# Altium schematic sheet PCB_3.SchDoc
size A4; SheetNumber: 1; SheetTotal: 4
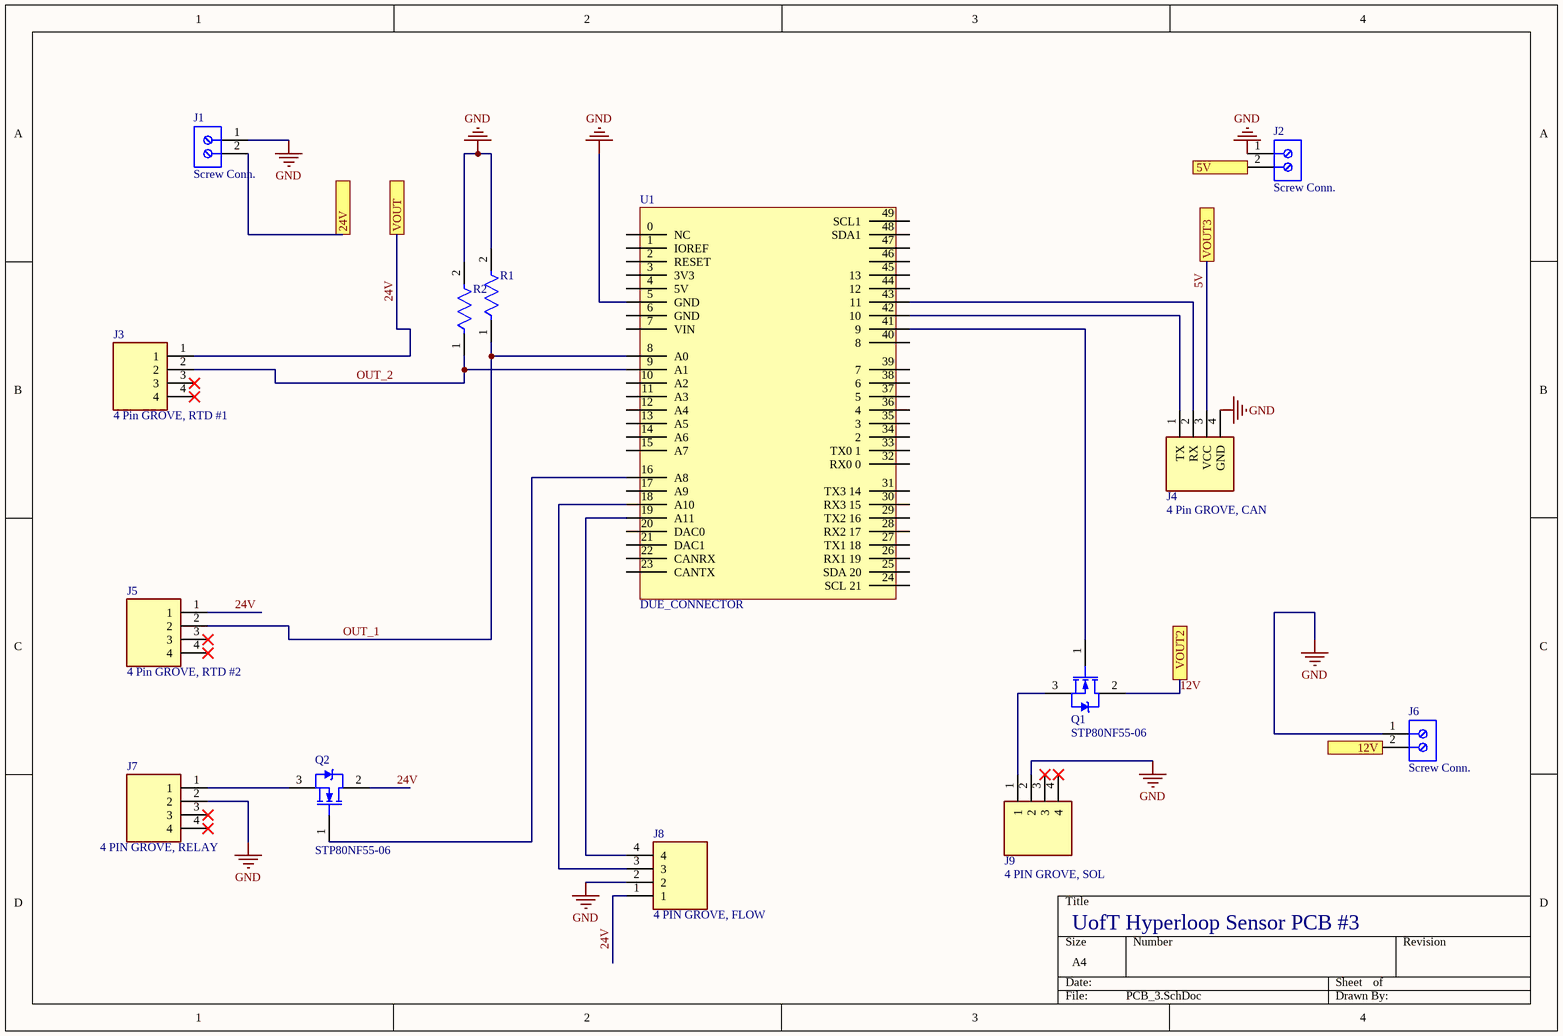
[diagram p0: PCB_3.SchDoc]

## Parts
J1  Screw Conn.  [PHOE-1714955_V]
J2  Screw Conn.  [PHOE-1714955_V]
J3  4 Pin GROVE, RTD #1  [SEEED_110990030]
J4  4 Pin GROVE, CAN  [SEEED_110990030]
J5  4 Pin GROVE, RTD #2  [SEEED_110990030]
J6  Screw Conn.  [PHOE-1714955_V]
J7  4 PIN GROVE, RELAY  [SEEED_110990030]
J8  4 PIN GROVE, FLOW  [SEEED_110990030]
J9  4 PIN GROVE, SOL  [SEEED_110990030]
Q1  STP80NF55-06  [STM-TO-220A-3]
Q2  STP80NF55-06  [STM-TO-220A-3]
R1  (no value)  [FP-MBA0204-MFG]
R2  (no value)  [FP-MBA0204-MFG]
U1  DUE_CONNECTOR  [DUE_FOOTPRINT]

## Ports
5V, 12V, 24V, VOUT, VOUT2, VOUT3

## Nets
GND: J1.1 J2.1 J4.4(GND) J6.1 J7.2 J8.2 J9.2 R1.2 R2.2 U1.5(GND)
5V: J4.3(VCC) ; port VOUT3
5V: J2.2 ; port 5V  [a separate net that carries the same name]
12V: Q1.2(D) ; port VOUT2
12V: J6.2 ; port 12V  [a separate net that carries the same name]
24V: J3.1 J5.1 J8.1 Q2.2(D) ; port VOUT
24V: J1.2 ; port 24V  [a separate net that carries the same name]
OUT_1: J5.2 R1.1 U1.8(A0)
OUT_2: J3.2 R2.1 U1.9(A1)
NetJ4_1: J4.1(TX) U1.42(10)
NetJ4_2: J4.2(RX) U1.43(11)
NetJ7_1: J7.1 Q2.3(S)
NetJ8_3: J8.3 U1.18(A10)
NetJ8_4: J8.4 U1.19(A11)
NetJ9_1: J9.1 Q1.3(S)
NetQ1_1: Q1.1(G) U1.41(9)
NetQ2_1: Q2.1(G) U1.16(A8)

Not connected (* = marked no-connect by the designer): J3 3* 4*; J5 3* 4*; J7 3* 4*; J9 3* 4*; U1 0(NC) 1(IOREF) 2(RESET) 3(3V3) 4(5V) 6(GND) 7(VIN) 10(A2) 11(A3) 12(A4) 13(A5) 14(A6) 15(A7) 17(A9) 20(DAC0) 21(DAC1) 22(CANRX) 23(CANTX) 24(SCL_21) 25(SDA_20) 26(RX1_19) 27(TX1_18) 28(RX2_17) 29(TX2_16) 30(RX3_15) 31(TX3_14) 32(RX0_0) 33(TX0_1) 34(2) 35(3) 36(4) 37(5) 38(6) 39(7) 40(8) 44(12) 45(13) 46 47 48(SDA1) 49(SCL1)

## Notes on the sheet
- UofT Hyperloop Sensor PCB #3

## Library data of the parts
J1 J2 J6 = CMP-2000-05797-1: PC Terminal Block, Pitch 6.35 mm, 1 x 2 Position, Height 21.5 mm, Tail Lenght 5.1 mm, RoHS, Bulk; Manufacturer: Phoenix Contact; Package Description: PC Terminal Block, Pitch 6.35 mm, 1 x 2 Position, Height 21.5 mm, Tail Lenght 5.1 mm; Datasheet URL: http://media.digikey.com/pdf/Data%20Sheets/Phoenix%20Contact%20PDFs/1714955.pdf; Package Reference: 1714955; Manufacturer URL: http://www.phoenixcontact.com/; Datasheet Version: 02/2010; Mounting Technology: ThroughHole
J3-J5 J7-J9 = 110990030: GROVE 2MM 4PIN VERT CONN 10PCS; MF: Seeed Technology; Arrow_Electronics-Purchase-URL: https://snapeda.com/shop?store=Arrow+Electronics&id=583576; Availability: Good; Package: None; Price: None; Mouser-Purchase-URL: https://snapeda.com/shop?store=Mouser&id=583576; MP: 110990030; SnapEDA_Link: https://www.snapeda.com/parts/110990030/Seeed%20Technology%20Co.,%20Ltd/view-part/583576/?ref=snap; Value: *
Q1 Q2 = CMP-2000-07168-1: N-Channel STripFET(TM) II Power MOSFET, 55 V, 80 A, 5 mOhm, -55 to 175 degC, 3-Pin TO-220, RoHS, Tube; Manufacturer: STMicroelectronics; Minimum Gate Threshold Voltage: 2V; Maximum Gate Threshold Voltage: 4V; Channel Type: N; Maximum Drain Source Voltage: 55V; Transistor Configuration: Single; Maximum Drain Source Resistance: 0.007Ω; Number of Elements per Chip: 1; Maximum Continuous Drain Current: 80A; Typical Gate Charge @ Vgs: 142nC@10V; Channel Mode: Enhancement; Typical Turn-Off Delay Time: 125ns; Maximum Gate Source Voltage: ±20V; Transistor Material: Si; Maximum Power Dissipation: 300W; Typical Input Capacitance @ Vds: 4400pF@25V; Typical Turn-On Delay Time: 27ns; Length: 10.4mm; Datasheet Version: Rev. 8, 10/2006; Package Type: TO-220; Minimum Operating Temperature: -55°C; Pin Count: 3; Package Description: 3-Pin Transistor Outline Package, 10.2 x 4.5 mm, Pitch 2.55 mm; Mounting Type: ThroughHole; Datasheet URL: http://www.st.com/content/ccc/resource/technical/document/datasheet/f1/46/49/9e/39/8f/49/aa/CD00002670.pdf/files/CD00002670.pdf/jcr:content/translations/en.CD00002670.pdf; Manufacturer URL: http://www.st.com/; Package URL: http://www.st.com/st-web-ui/static/active/en/resource/technical/document/datasheet/CD00000544.pdf; Height: 9.15mm; Width: 4.6mm; Dimensions: 10.4x4.6x9.15mm; Maximum Operating Temperature: +175°C; Category: PowerMOSFET; Package Reference: TO-220; Mounting Technology: ThroughHole
R1 R2 = CMP-02408-000005-1: RES 220 OHM 0.4W 1% AXIAL; Manufacturer Part Number: MBA02040C2200FC100; Manufacturer: Vishay BC Components; Automotive Grade: Grade 1; Value: 220Ω; Voltage Rating: 200V; Temperature Coefficient: 50ppm/°C; Power Rating: 0.25W; Digikey Description: RES 220 OHM 0.4W 1% AXIAL; Height: 1.6mm; Automotive: Yes; Lead Free: Yes; Mouser Description: Thin Film Resistors - Through Hole .4watt 220ohms 1% 1/8watt body size; Temperature Range Low: -55°C; ComponentLink2Description: Datasheet; Temperature: -55°C to +125°C; Device Class L3: Through-Hole Resistors; Ipc Land Pattern Name: RESAD500W65L360D160; Octopart: https://octopart.com/mba02040c2200fc100-vishay-43743094; Series: MBA/SMA 0204; RoHS: TRUE; Tolerance: 1%; Package: MBA0204; Device Class L1: Passive Components; ComponentLink2URL: http://www.vishay.com/docs/28766/mbxsma.pdf; Category: Res; Composition: Metal Film; Device Class L2: Resistors; Temperature Range High: +125°C; Resistance: 220Ω